# EAGLE schematic ExpressCarduino (EAGLE 9.1.2)
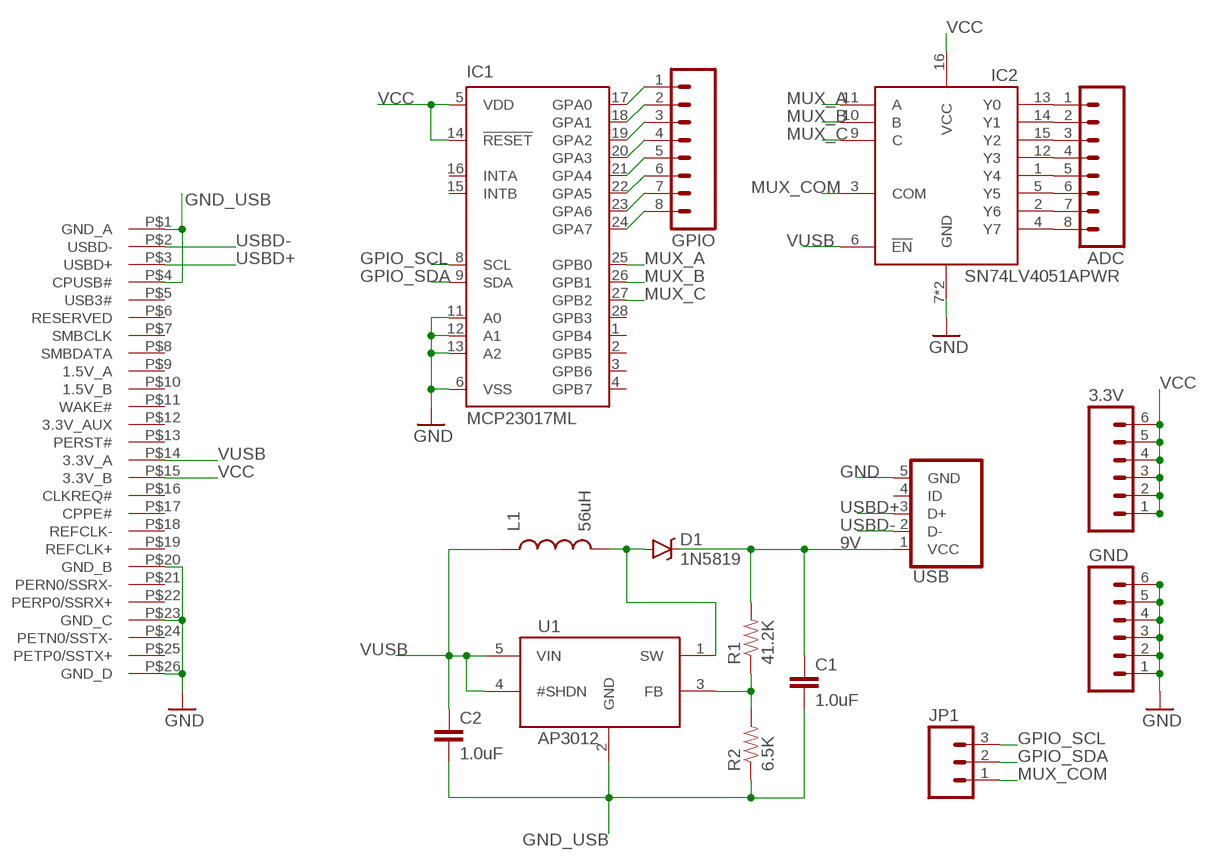
[diagram p0: schematic, sheet 1]

## Parts
3.3V  M06SILK_FEMALE_PTH  [1X06]
ADC  M08  [1X08_ROUND]
C1  1.0uF  1.0UF-16V-10%(0603)  [0603-CAP]
C2  1.0uF  1.0UF-16V-10%(0603)  [0603-CAP]
D1  1N5819  DIODE-SCHOTTKY  [SOD-123]
GND  M06SILK_FEMALE_PTH  [1X06]
GPIO  M08  [1X08_ROUND]
IC1  MCP23017ML  [QFN28-ML_6X6MM]
IC2  SN74LV4051APWR  [TSSOP16]
JP1  M03PTH  [1X03]
L1  56uH  INDUCTORSDR0403-560KL  [SDR0403]
R1  41.2K  0.22OHM-1/4W-1%(0805)  [0805]
R2  6.5K  0.22OHM-1/4W-1%(0805)  [0805]
U1  AP3012  [SOT23-5]
U$1  EXPRESSCARD34  [EXPRESSCARD34]
USB  USB_MICROB_PLUG"  [MICRO-B-RA-SMT]

## Nets
9V: C1.1 D1.C R1.2 USB.1(VCC)
GND: GND.1 GND.2 GND.3 GND.4 GND.5 GND.6 IC1.6(VSS) IC1.11(A0) IC1.12(A1) IC1.13(A2) IC2.7(GND) IC2.8(GND) U$1.P$20(GND_B) U$1.P$23(GND_C) U$1.P$26(GND_D) USB.5(GND)
GND_USB: C1.2 C2.2 R2.1 U1.2(GND) U$1.P$1(GND_A) U$1.P$4(CPUSB#)
GPIO_SCL: IC1.8(SCL) JP1.3
GPIO_SDA: IC1.9(SDA) JP1.2
MUX_A: IC1.25(GPB0) IC2.11(A)
MUX_B: IC1.26(GPB1) IC2.10(B)
MUX_C: IC1.27(GPB2) IC2.9(C)
MUX_COM: IC2.3(COM) JP1.1
N$1: R1.1 R2.2 U1.3(FB)
N$2: GPIO.1 IC1.17(GPA0)
N$3: D1.A L1.P$2 U1.1(SW)
N$4: GPIO.2 IC1.18(GPA1)
N$5: GPIO.3 IC1.19(GPA2)
N$6: GPIO.4 IC1.20(GPA3)
N$7: GPIO.5 IC1.21(GPA4)
N$8: GPIO.6 IC1.22(GPA5)
N$9: GPIO.7 IC1.23(GPA6)
N$10: GPIO.8 IC1.24(GPA7)
N$19: ADC.1 IC2.13(Y0)
N$20: ADC.2 IC2.14(Y1)
N$21: ADC.3 IC2.15(Y2)
N$22: ADC.4 IC2.12(Y3)
N$23: ADC.5 IC2.1(Y4)
N$24: ADC.6 IC2.5(Y5)
N$25: ADC.7 IC2.2(Y6)
N$26: ADC.8 IC2.4(Y7)
USBD+: U$1.P$3(USBD+) USB.3(D+)
USBD-: U$1.P$2(USBD-) USB.2(D-)
VCC: 3.3V.1 3.3V.2 3.3V.3 3.3V.4 3.3V.5 3.3V.6 IC1.5(VDD) IC1.14(!RESET) IC2.16(VCC) U$1.P$15(3.3V_B)
VUSB: C2.1 IC2.6(!EN) L1.P$1 U1.4(#SHDN) U1.5(VIN) U$1.P$14(3.3V_A)
Unconnected: IC1.1(GPB4) IC1.2(GPB5) IC1.3(GPB6) IC1.4(GPB7) IC1.15(INTB) IC1.16(INTA) IC1.28(GPB3) U$1.P$5(USB3#) U$1.P$6(RESERVED) U$1.P$7(SMBCLK) U$1.P$8(SMBDATA) U$1.P$9(1.5V_A) U$1.P$10(1.5V_B) U$1.P$11(WAKE#) U$1.P$12(3.3V_AUX) U$1.P$13(PERST#) U$1.P$16(CLKREQ#) U$1.P$17(CPPE#) U$1.P$18(REFCLK-) U$1.P$19(REFCLK+) U$1.P$21(PERN0/SSRX-) U$1.P$22(PERP0/SSRX+) U$1.P$24(PETN0/SSTX-) U$1.P$25(PETP0/SSTX+) USB.4(ID)

## Library data of the parts
3.3V GND = SparkFun-Connectors:M06: Header 6 Standard 6-pin 0.1" header. Use with straight break away headers (SKU : PRT-00116), right angle break away headers (PRT-00553), swiss pins (PRT-00743), machine pins (PRT-00117), and female headers (PRT-00115). Molex polarized connector foot print use with SKU : PRT-08094 with associated crimp pins and housings. NOTES ON THE VARIANTS LOCK and LOCK_LONGPADS... This footprint was designed to help hold the alignment of a through-hole component (i.e. 6-pin header) while soldering it into place. You may notice that each hole has been shifted either up or down by 0.005 of an inch from it's more standard position (which is a perfectly straight line). This slight alteration caused the pins (the squares in the middle) to touch the edges of the holes. Because they are alternating, it causes a "brace" to hold the component in place. 0.005 has proven to be the perfect amount of "off-center" position when using our standard breakaway headers. Although looks a little odd when you look at the bare footprint, once you have a header in there, the alteration is very hard to notice. Also,if you push a header all the way into place, it is covered up entirely on the bottom side. This idea of altering the position of holes to aid alignment will be further integrated into the Sparkfun Library for other footprints. It can help hold any component with 3 or more connection pins.; PROD_ID: CONN-08437
ADC GPIO = SparkFun-Connectors:M08: Header 8 Standard 8-pin 0.1" header. Use with straight break away headers (SKU : PRT-00116), right angle break away headers (PRT-00553), swiss pins (PRT-00743), machine pins (PRT-00117), and female headers (PRT-00115).
C1 C2 = SparkFun-Capacitors:1.0UF-16V-10%(0603): CAP-00868; PROD_ID: CAP-00868
D1 = HokieGeek:DIODE-SCHOTTKY: Schottky diodes in SFE's production catalog BAT20J 1A 23V 0.62Vf RB751 120mA 40V 0.37Vf PMEG4005EJ 0.5A 40V 0.42Vf MBRA140 1A 40V 0.5Vf B340A 3A 40V SMA
IC1 = adafruit:MCP23017: http://ww1.microchip.com/downloads/en/DeviceDoc/21952a.pdf Source: http://ww1.microchip.com/downloads/en/DeviceDoc/21952a.pdf
IC2 = HokieGeek:SN74LV4051A
JP1 = SparkFun-Connectors:M03: Header 3 Standard 3-pin 0.1" header. Use with straight break away headers (SKU : PRT-00116), right angle break away headers (PRT-00553), swiss pins (PRT-00743), machine pins (PRT-00117), and female headers (PRT-00115). Molex polarized connector foot print use with SKU : PRT-08232 with associated crimp pins and housings.
L1 = SparkFun-Passives:INDUCTOR: Inductors Basic Inductor/Choke - 0603 and 1206. Footprints are not proven and vary greatly between part numbers. INDUCTOR POWER 3.3UH 4.0A SMD 0.197" L x 0.197" W x 0.177" H (5.00mm x 5.00mm x 4.50mm); DIST: DIGIKEY; DIST_ID: SDR0403-560KLCT-ND
R1 R2 = SparkFun-Resistors:0.22OHM-1/4W-1%(0805): RES-09883; PROD_ID: RES-09883; VALUE: 0.22
U1 = HokieGeek:AP3012: Single-gate AND logic; PROD_ID: 10841; VALUE: 74LVC1G08
U$1 = HokieGeek:EXPRESSCARD34: Pads for an SMD mounted ExpressCard
USB = HokieGeek:USB_MICROB_PLUG: USB Micro-B connectors Some male, some female. Watch your step!